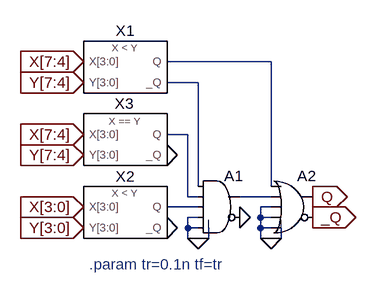
[diagram p0: schematic lt-8bit.asc]
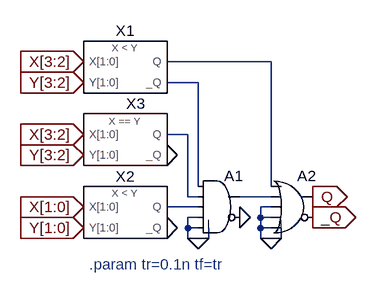
[diagram p1: sub-circuit lt-4bit.asc]
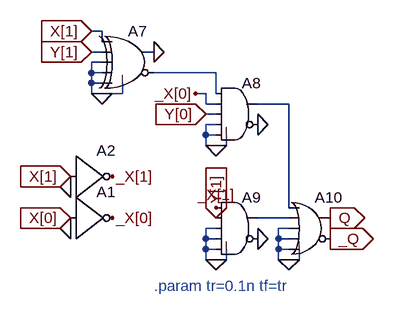
[diagram p2: sub-circuit lt-2bit.asc]
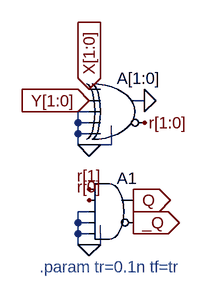
[diagram p3: sub-circuit eq-2bit.asc]
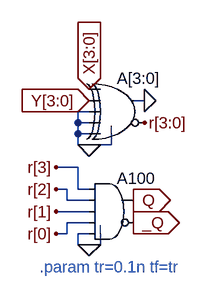
[diagram p4: sub-circuit eq-4bit.asc]
lt-8bit.asc, the LTspice schematic file:
Version 4
SHEET 1 880 680
WIRE 304 64 144 64
WIRE 192 96 144 96
WIRE 176 176 144 176
WIRE 192 256 192 96
WIRE 304 256 304 64
WIRE 176 272 176 176
WIRE 192 272 176 272
WIRE 304 272 256 272
WIRE 192 288 144 288
WIRE 304 288 288 288
WIRE 192 304 176 304
WIRE 288 304 288 288
WIRE 304 304 288 304
WIRE 176 320 176 304
WIRE 192 320 176 320
WIRE 288 320 288 304
WIRE 304 320 288 320
WIRE 176 336 176 320
WIRE 192 336 176 336
WIRE 208 336 208 320
WIRE 208 336 192 336
WIRE 288 336 288 320
WIRE 304 336 288 336
WIRE 320 336 320 320
WIRE 320 336 304 336
FLAG 16 64 X[7:4]
IOPIN 16 64 In
FLAG 16 288 X[3:0]
IOPIN 16 288 In
FLAG 16 96 Y[7:4]
IOPIN 16 96 In
FLAG 16 320 Y[3:0]
IOPIN 16 320 In
FLAG 192 336 0
FLAG 256 304 0
FLAG 304 336 0
FLAG 368 272 Q
IOPIN 368 272 Out
FLAG 368 304 _Q
IOPIN 368 304 Out
FLAG 144 320 0
FLAG 16 176 X[7:4]
IOPIN 16 176 In
FLAG 16 208 Y[7:4]
IOPIN 16 208 In
FLAG 144 208 0
SYMBOL Digital\\and 224 224 R0
SYMATTR InstName A1
SYMBOL Digital\\or 336 224 R0
SYMATTR InstName A2
SYMBOL lt-4bit 80 80 R0
SYMATTR InstName X1
SYMBOL lt-4bit 80 304 R0
SYMATTR InstName X2
SYMBOL eq-4bit 96 192 R0
SYMATTR InstName X3
TEXT 24 376 Left 2 ;.param tr=0.1n tf=tr

lt-4bit.asc, the sub-circuit schematic file:
Version 4
SHEET 1 880 680
WIRE 304 64 144 64
WIRE 192 96 144 96
WIRE 176 176 144 176
WIRE 192 256 192 96
WIRE 304 256 304 64
WIRE 176 272 176 176
WIRE 192 272 176 272
WIRE 304 272 256 272
WIRE 192 288 144 288
WIRE 304 288 288 288
WIRE 192 304 176 304
WIRE 288 304 288 288
WIRE 304 304 288 304
WIRE 176 320 176 304
WIRE 192 320 176 320
WIRE 288 320 288 304
WIRE 304 320 288 320
WIRE 176 336 176 320
WIRE 192 336 176 336
WIRE 208 336 208 320
WIRE 208 336 192 336
WIRE 288 336 288 320
WIRE 304 336 288 336
WIRE 320 336 320 320
WIRE 320 336 304 336
FLAG 16 64 X[3:2]
IOPIN 16 64 In
FLAG 16 288 X[1:0]
IOPIN 16 288 In
FLAG 16 176 X[3:2]
IOPIN 16 176 In
FLAG 16 96 Y[3:2]
IOPIN 16 96 In
FLAG 16 208 Y[3:2]
IOPIN 16 208 In
FLAG 16 320 Y[1:0]
IOPIN 16 320 In
FLAG 192 336 0
FLAG 256 304 0
FLAG 304 336 0
FLAG 368 272 Q
IOPIN 368 272 Out
FLAG 368 304 _Q
IOPIN 368 304 Out
FLAG 144 320 0
FLAG 144 208 0
SYMBOL lt-2bit 80 80 R0
SYMATTR InstName X1
SYMBOL lt-2bit 80 304 R0
SYMATTR InstName X2
SYMBOL eq-2bit 96 192 R0
WINDOW 0 0 -48 Bottom 2
SYMATTR InstName X3
SYMBOL Digital\\and 224 224 R0
SYMATTR InstName A1
SYMBOL Digital\\or 336 224 R0
SYMATTR InstName A2
TEXT 24 376 Left 2 ;.param tr=0.1n tf=tr

lt-2bit.asc, the sub-circuit schematic file:
Version 4
SHEET 1 880 680
WIRE 336 208 320 208
WIRE 336 224 336 208
WIRE 336 240 320 240
WIRE 416 240 400 240
WIRE 336 256 320 256
WIRE 320 272 320 256
WIRE 336 272 320 272
WIRE 512 272 416 272
WIRE 320 288 320 272
WIRE 336 288 320 288
WIRE 320 304 320 288
WIRE 336 304 320 304
WIRE 368 304 368 288
WIRE 368 304 336 304
WIRE 496 304 480 304
WIRE 512 304 512 272
WIRE 496 320 496 304
WIRE 512 320 496 320
WIRE 624 320 576 320
WIRE 512 336 496 336
WIRE 512 352 496 352
WIRE 496 368 496 352
WIRE 512 368 496 368
WIRE 496 384 496 368
WIRE 512 384 496 384
WIRE 528 384 528 368
WIRE 528 384 512 384
WIRE 624 480 624 320
WIRE 624 496 576 496
WIRE 512 512 496 512
WIRE 624 512 608 512
WIRE 496 528 496 512
WIRE 512 528 496 528
WIRE 608 528 608 512
WIRE 624 528 608 528
WIRE 496 544 496 528
WIRE 512 544 496 544
WIRE 608 544 608 528
WIRE 624 544 608 544
WIRE 496 560 496 544
WIRE 512 560 496 560
WIRE 528 560 528 544
WIRE 528 560 512 560
WIRE 608 560 608 544
WIRE 624 560 608 560
WIRE 640 560 640 544
WIRE 640 560 624 560
FLAG 288 448 0
FLAG 288 432 X[1]
IOPIN 288 432 In
FLAG 352 432 _X[1]
FLAG 480 304 _X[0]
FLAG 496 336 Y[0]
IOPIN 496 336 In
FLAG 288 512 0
FLAG 288 496 X[0]
IOPIN 288 496 In
FLAG 352 496 _X[0]
FLAG 320 240 Y[1]
IOPIN 320 240 In
FLAG 320 208 X[1]
IOPIN 320 208 In
FLAG 336 304 0
FLAG 512 384 0
FLAG 576 352 0
FLAG 416 240 0
FLAG 512 560 0
FLAG 576 528 0
FLAG 512 496 Y[1]
IOPIN 512 496 In
FLAG 512 480 _X[1]
FLAG 624 560 0
FLAG 688 496 Q
IOPIN 688 496 Out
FLAG 688 528 _Q
IOPIN 688 528 Out
SYMBOL Digital\\inv 288 368 R0
SYMATTR InstName A2
SYMBOL Digital\\and 544 272 R0
SYMATTR InstName A8
SYMBOL Digital\\and 544 448 R0
SYMATTR InstName A9
SYMBOL Digital\\or 656 448 R0
SYMATTR InstName A10
SYMBOL Digital\\xor 384 192 R0
SYMATTR InstName A7
SYMBOL Digital\\inv 288 432 R0
SYMATTR InstName A1
TEXT 416 600 Left 2 ;.param tr=0.1n tf=tr

eq-2bit.asc, the sub-circuit schematic file:
Version 4
SHEET 1 880 680
WIRE 176 112 160 112
WIRE 96 128 80 128
WIRE 80 144 80 128
WIRE 96 144 80 144
WIRE 80 160 80 144
WIRE 96 160 80 160
WIRE 80 176 80 160
WIRE 96 176 80 176
WIRE 128 176 128 160
WIRE 128 176 96 176
WIRE 96 272 80 272
WIRE 80 288 80 272
WIRE 96 288 80 288
WIRE 80 304 80 288
WIRE 96 304 80 304
WIRE 80 320 80 304
WIRE 96 320 80 320
WIRE 112 320 112 304
WIRE 112 320 96 320
FLAG 96 176 0
FLAG 96 96 X[1:0]
IOPIN 96 96 In
FLAG 96 112 Y[1:0]
IOPIN 96 112 In
FLAG 176 112 0
FLAG 176 144 r[1:0]
FLAG 96 320 0
FLAG 96 240 r[1]
FLAG 96 256 r[0]
FLAG 160 256 Q
IOPIN 160 256 Out
FLAG 160 288 _Q
IOPIN 160 288 Out
SYMBOL Digital\\xor 144 64 R0
SYMATTR InstName A[1:0]
SYMBOL Digital\\and 128 208 R0
SYMATTR InstName A1
TEXT 24 352 Left 2 ;.param tr=0.1n tf=tr

eq-4bit.asc, the sub-circuit schematic file:
Version 4
SHEET 1 880 680
WIRE 176 112 160 112
WIRE 96 128 80 128
WIRE 80 144 80 128
WIRE 96 144 80 144
WIRE 80 160 80 144
WIRE 96 160 80 160
WIRE 80 176 80 160
WIRE 96 176 80 176
WIRE 128 176 128 160
WIRE 128 176 96 176
WIRE 80 208 48 208
WIRE 64 240 48 240
WIRE 80 240 80 208
WIRE 96 240 80 240
WIRE 64 256 64 240
WIRE 96 256 64 256
WIRE 96 272 48 272
WIRE 96 288 64 288
WIRE 64 304 64 288
WIRE 64 304 48 304
WIRE 96 304 80 304
WIRE 80 320 80 304
WIRE 96 320 80 320
WIRE 112 320 112 304
WIRE 112 320 96 320
FLAG 96 176 0
FLAG 96 96 X[3:0]
IOPIN 96 96 In
FLAG 96 112 Y[3:0]
IOPIN 96 112 In
FLAG 176 112 0
FLAG 176 144 r[3:0]
FLAG 96 320 0
FLAG 48 208 r[3]
FLAG 48 240 r[2]
FLAG 160 256 Q
IOPIN 160 256 Out
FLAG 160 288 _Q
IOPIN 160 288 Out
FLAG 48 272 r[1]
FLAG 48 304 r[0]
SYMBOL Digital\\xor 144 64 R0
SYMATTR InstName A[3:0]
SYMBOL Digital\\and 128 208 R0
SYMATTR InstName A100
TEXT 24 352 Left 2 ;.param tr=0.1n tf=tr

The netlist it stands for:
* lt-8bit.asc
A1 N002 N003 N005 0 0 0 N004 0 AND
A2 N001 N004 0 0 0 _Q Q 0 OR
XX1 X[7] X[6] X[5] X[4] Y[7] Y[6] Y[5] Y[4] N002 N001 lt-4bit
XX2 X[3] X[2] X[1] X[0] Y[3] Y[2] Y[1] Y[0] 0 N005 lt-4bit
XX3 X[7] X[6] X[5] X[4] Y[7] Y[6] Y[5] Y[4] 0 N003 eq-4bit

* block symbol definitions
.subckt lt-4bit X[3] X[2] X[1] X[0] Y[3] Y[2] Y[1] Y[0] _Q Q
XX1 X[3] X[2] Y[3] Y[2] N002 N001 lt-2bit
XX2 X[1] X[0] Y[1] Y[0] 0 N005 lt-2bit
XX3 X[3] X[2] Y[3] Y[2] 0 N003 eq-2bit
A1 N002 N003 N005 0 0 0 N004 0 AND
A2 N001 N004 0 0 0 _Q Q 0 OR
* .param tr=0.1n tf=tr
.ends lt-4bit

.subckt lt-2bit X[1] X[0] Y[1] Y[0] _Q Q
A2 X[1] 0 0 0 0 _X[1] 0 0 BUF
A8 N001 _X[0] Y[0] 0 0 0 N002 0 AND
A9 _X[1] Y[1] 0 0 0 0 N003 0 AND
A10 N002 N003 0 0 0 _Q Q 0 OR
A7 X[1] Y[1] 0 0 0 N001 0 0 XOR
A1 X[0] 0 0 0 0 _X[0] 0 0 BUF
* .param tr=0.1n tf=tr
.ends lt-2bit

.subckt eq-2bit X[1] X[0] Y[1] Y[0] _Q Q
A[1:0] X[1:0] Y[1:0] 0 0 0 r[1:0] 0 0 XOR
A1 r[1] r[0] 0 0 0 _Q Q 0 AND
* .param tr=0.1n tf=tr
.ends eq-2bit

.subckt eq-4bit X[3] X[2] X[1] X[0] Y[3] Y[2] Y[1] Y[0] _Q Q
A[3:0] X[3:0] Y[3:0] 0 0 0 r[3:0] 0 0 XOR
A100 r[3] r[2] r[1] r[0] 0 _Q Q 0 AND
* .param tr=0.1n tf=tr
.ends eq-4bit

* .param tr=0.1n tf=tr
.backanno
.end